# Altium schematic sheet Sheet1.SchDoc (part 1 of 5)
size A2; SheetNumber: 1; SheetTotal: 1
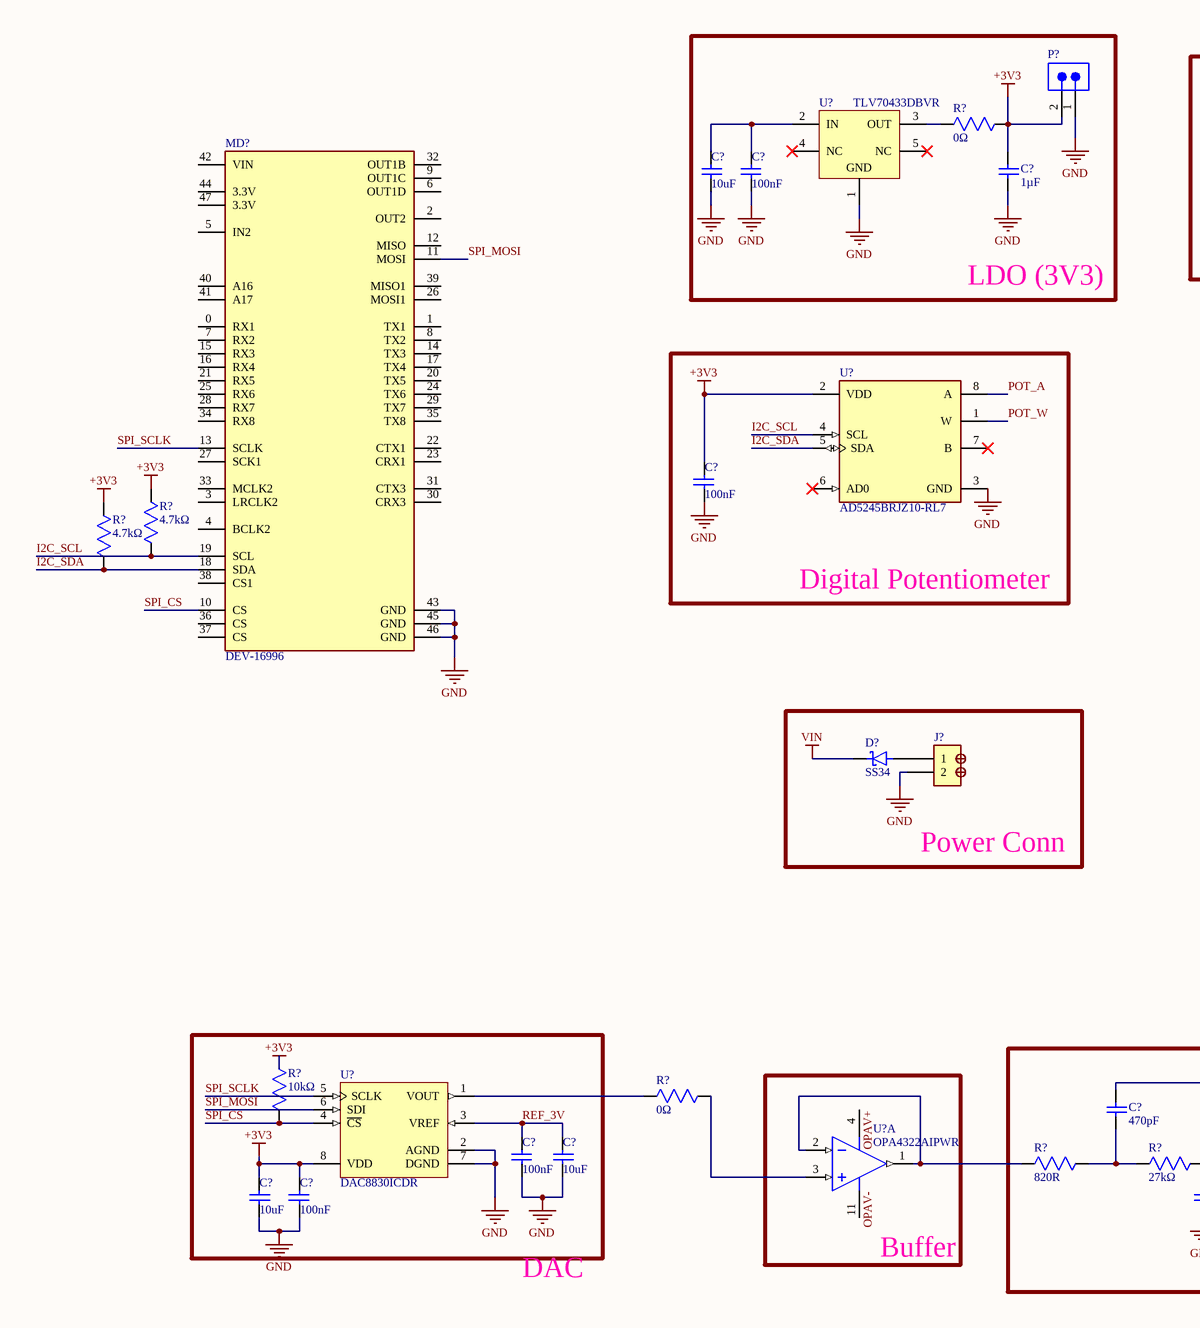
[diagram p0: Sheet1.SchDoc, left]
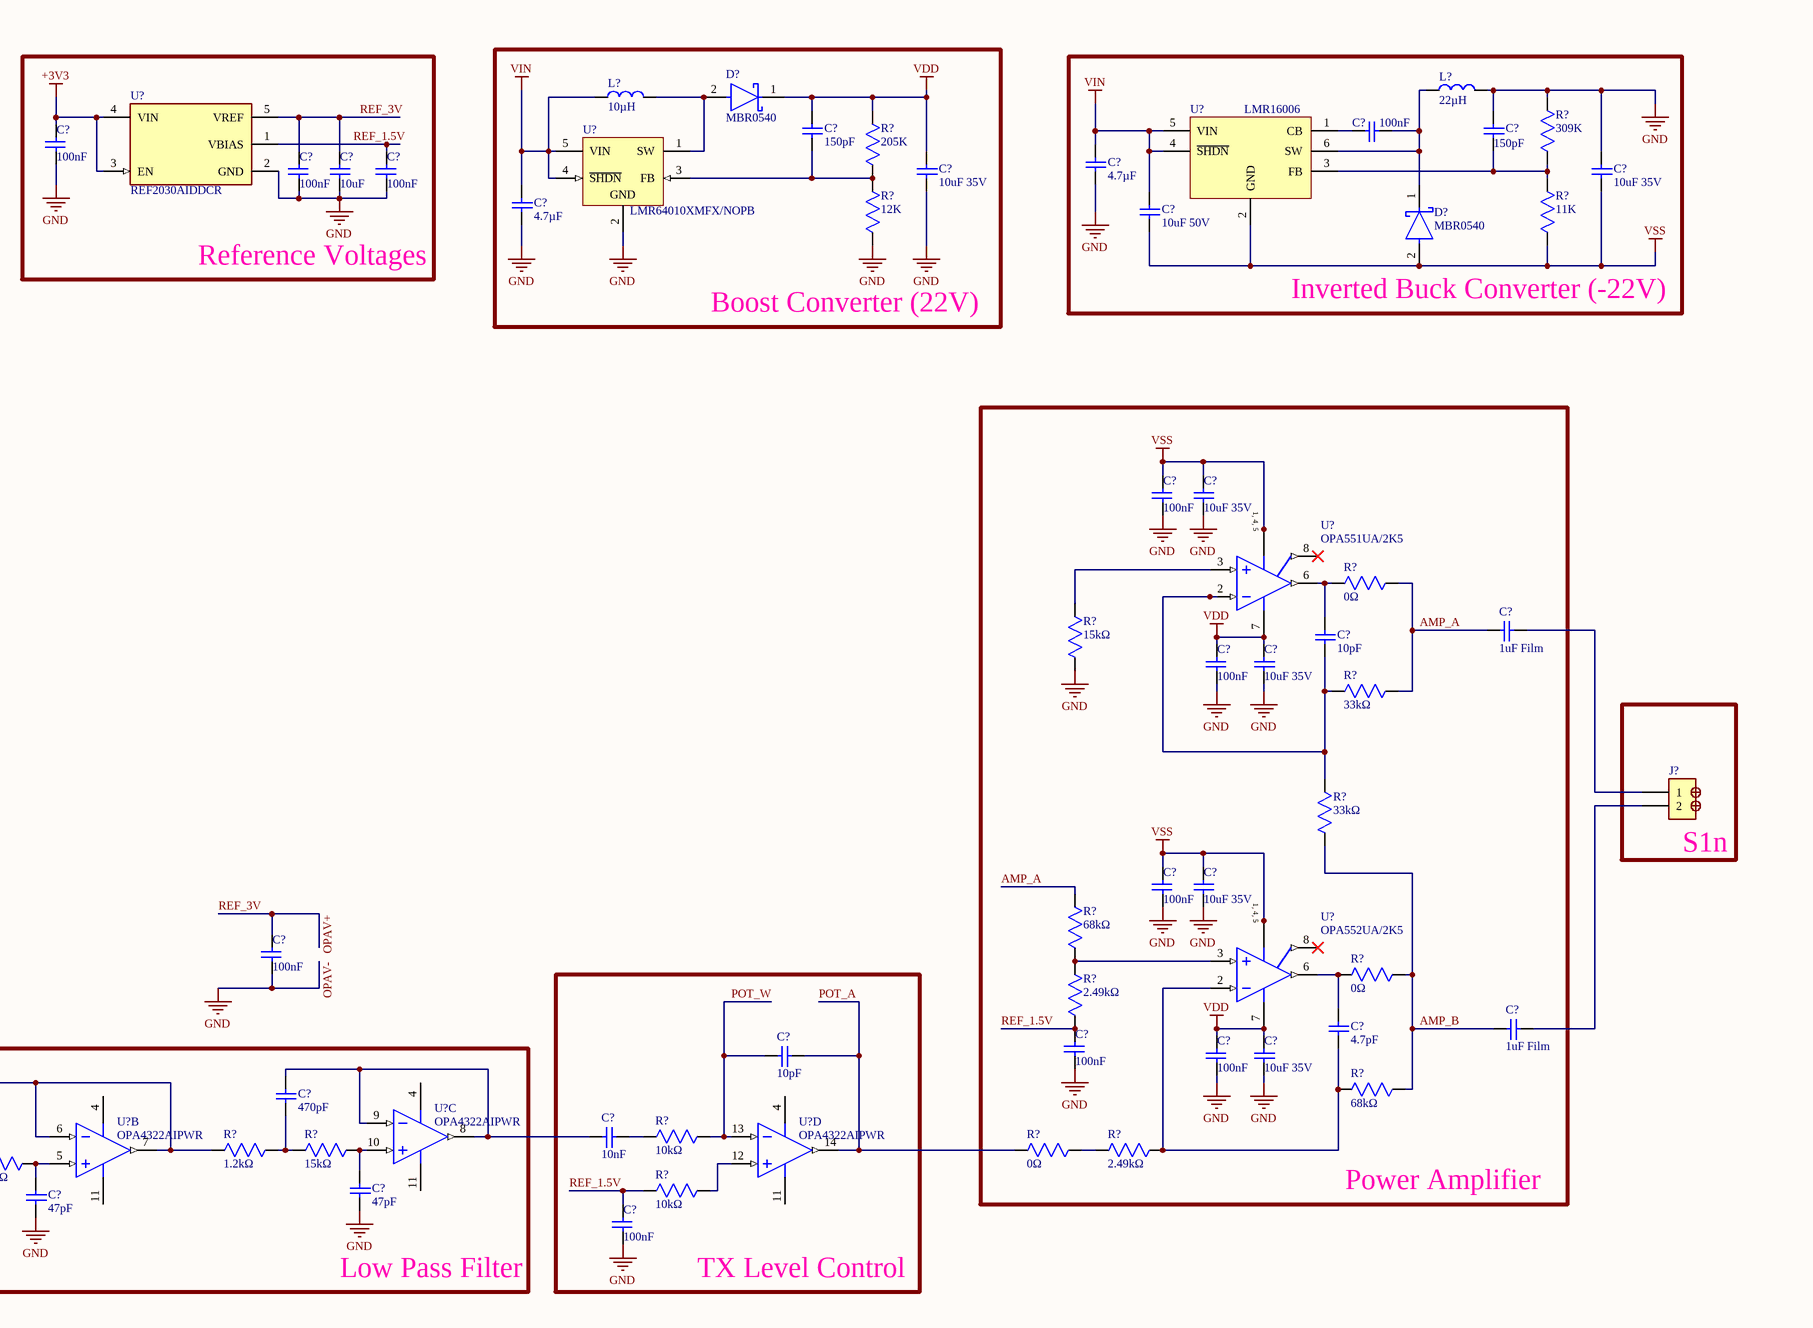
[diagram p1: Sheet1.SchDoc, right]

## Parts
(Parts that share a designator on the sheet are numbered #1, #2 ... from top to bottom, then left to right.)
C?#1  100nF  [CAP_0603]
C?#2  100nF  [CAP_0603]
C?#3  100nF  [CAP_0603]
C?#4  100nF  [CAP_0603]
C?#5  100nF  [CAP_0603]
C?#6  150pF  [CAP_0603]
C?#7  150pF  [CAP_0603]
C?#8  4.7µF  [CAP_0603]
C?#9  10uF  [CAP_0603]
C?#10  1µF  [CAP_0603]
C?#11  10uF  [CAP_0603]
C?#12  10uF 35V  [CAP_0603]
C?#13  10uF 35V  [CAP_0603]
C?#14  4.7µF  [CAP_0603]
C?#15  10uF 50V  [CAP_0603]
C?#16  100nF  [CAP_0603]
C?#17  100nF  [CAP_0603]
C?#18  10uF 35V  [CAP_0603]
C?#19  1uF Film  [PE105J2A0502]
C?#20  100nF  [CAP_0603]
C?#21  10pF  [CAP_0603]
C?#22  10uF 35V  [CAP_0603]
C?#23  100nF  [CAP_0603]
C?#24  10uF 35V  [CAP_0603]
C?#25  100nF  [CAP_0603]
C?#26  100nF  [CAP_0603]
C?#27  1uF Film  [PE105J2A0502]
C?#28  100nF  [CAP_0603]
C?#29  4.7pF  [CAP_0603]
C?#30  10pF  [CAP_0603]
C?#31  10uF 35V  [CAP_0603]
C?#32  470pF  [CAP_0603]
C?#33  470pF  [CAP_0603]
C?#34  100nF  [CAP_0603]
C?#35  10nF  [CAP_0603]
C?#36  100nF  [CAP_0603]
C?#37  10uF  [CAP_0603]
C?#38  100nF  [CAP_0603]
C?#39  47pF  [CAP_0603]
C?#40  10uF  [CAP_0603]
C?#41  47pF  [CAP_0603]
D?#1  MBR0540  [FP-425-04-MFG]
D?#2  MBR0540  [FP-425-04-MFG]
D?#3  SS34  [SS34]
J?#1  DB301V-3.5-2P-GN-S  [DB301V-3.5-2P-GN-S]  (value not drawn)
J?#2  DB301V-3.5-2P-GN-S  [DB301V-3.5-2P-GN-S]  (value not drawn)
L?#1  22µH  [SWPA5040S100MT]
L?#2  10µH  [SWPA5040S100MT]
MD?  DEV-16996  [FP-DEV-16996-MFG]
P?  DW-02-16-G-S-200  [SMTC-DW-02-16-X-S-200]  (value not drawn)
R?#1  0Ω
R?#2  309K  [RES_0603]
R?#3  205K  [RES_0603]
R?#4  12K  [RES_0603]
R?#5  11K  [RES_0603]
R?#6  4.7kΩ  [RES_0603]
R?#7  4.7kΩ  [RES_0603]
R?#8  0Ω
R?#9  15kΩ  [RES_0603]
R?#10  33kΩ  [RES_0603]
R?#11  33kΩ  [RES_0603]
R?#12  68kΩ  [RES_0603]
R?#13  0Ω
R?#14  2.49kΩ  [RES_0603]
R?#15  68kΩ  [RES_0603]
R?#16  0Ω
R?#17  10kΩ  [CAP_0603]
R?#18  10kΩ  [CAP_0603]
R?#19  1.2kΩ  [RES_0603]
R?#20  15kΩ  [RES_0603]
R?#21  0Ω
R?#22  2.49kΩ  [RES_0603]
R?#23  820R  [RES_0603]
R?#24  27kΩ  [RES_0603]
R?#25  10kΩ  [CAP_0603]
U?#1  TLV70433DBVR  [DBV0005A_M]
U?#2  REF2030AIDDCR  [FP-DDC0005A-IPC_A]
U?#3  LMR16006  [LMR16006YDDCR]
U?#4  LMR64010XMFX/NOPB  [DBV0005A_N]
U?#5  AD5245BRJZ10-RL7  [FP-RJ-8-IPC_B]
U?#6  OPA551UA/2K5  [D0008A_N]
U?#7  OPA552UA/2K5  [D0008A_N]
U?#8  DAC8830ICDR  [TI-D8_M]
U?#9  OPA4322AIPWR  [PW0014A_N]  (part C of 4)
U?#10  OPA4322AIPWR  [PW0014A_N]  (part B of 4)
U?#11  OPA4322AIPWR  [PW0014A_N]  (part D of 4)
U?#12  OPA4322AIPWR  [PW0014A_N]  (part A of 4)

## Blocks framed on the sheet
LDO (3V3): C?#3 C?#9 C?#10 P? R?#1 U?#1
Reference Voltages: C?#1 C?#4 C?#5 C?#11 U?#2
Boost Converter (22V): C?#6 C?#12 C?#14 D?#1 L?#2 R?#3 R?#4 U?#4
Inverted Buck Converter (-22V): C?#2 C?#7 C?#8 C?#13 C?#15 D?#2 L?#1 R?#2 R?#5 U?#3
Digital Potentiometer: C?#16 U?#5
Power Amplifier: C?#17-C?#24 C?#26-C?#29 C?#31 R?#8-R?#15 R?#21 R?#22 U?#6 U?#7
Power Conn: D?#3 J?#1
S1n: J?#2
TX Level Control: C?#30 C?#35 C?#38 R?#18 R?#25 U?#11
Buffer: U?#12
Low Pass Filter: C?#32 C?#33 C?#39 C?#41 R?#19 R?#20 R?#23 R?#24 U?#9 U?#10

## Nets
+3V3: C?#1.1 C?#10.2 C?#16.1 C?#36.1 C?#40.2 P?.2 R?#1.2 R?#6.2 R?#7.2 R?#17.2 U?#2.3(EN) U?#2.4(VIN) U?#5.2(VDD) U?#8.8(VDD)
OPAV-: C?#1.2 C?#3.2 C?#4.2 C?#5.2 C?#7.2 C?#8.1 C?#9.1 C?#10.1 C?#11.1 C?#12.1 C?#13.2 C?#14.1 C?#16.2 C?#17.2 C?#18.1 C?#20.2 C?#22.1 C?#23.2 C?#24.1 C?#25.2 C?#26.2 C?#28.2 C?#31.1 C?#34.2 C?#36.2 C?#37.1 C?#38.2 C?#39.1 C?#40.1 C?#41.1 J?#1.2 L?#1.2 MD?.43(GND) MD?.45(GND) MD?.46(GND) P?.1 R?#2.2 R?#4.1 R?#9.1 U?#1.1(GND) U?#2.2(GND) U?#4.2(GND) U?#5.3(GND) U?#8.2(AGND) U?#8.7(DGND)  [also labelled GND]
VDD: C?#6.2 C?#12.2 C?#20.1 C?#22.2 C?#28.1 C?#31.2 D?#1.1(C) R?#3.2 U?#6.7(V+) U?#7.7(V+)
VIN: C?#8.2 C?#14.2 C?#15.2 D?#3.K L?#2.1 U?#3.4(~{SHDN}) U?#3.5(VIN) U?#4.4(~{SHDN}) U?#4.5(VIN)
VSS: C?#13.1 C?#15.1 C?#17.1 C?#18.2 C?#23.1 C?#24.2 D?#2.2(A) R?#5.1 U?#3.2(GND) U?#6.1(V-) U?#6.4(V-) U?#6.5(V-) U?#7.1(V-) U?#7.4(V-) U?#7.5(V-)
AMP_A: C?#19.1 R?#8.2 R?#10.1 R?#12.2
AMP_B: C?#27.1 R?#11.1 R?#13.2 R?#15.2
I2C_SCL: MD?.19(SCL) R?#6.1 U?#5.4(SCL)
I2C_SDA: MD?.18(SDA) R?#7.1 U?#5.5(SDA)
OPAV+: C?#4.1 C?#11.2 C?#25.1 C?#34.1 C?#37.2 U?#2.5(VREF) U?#8.3(VREF) U?#12.4(V+)  [also labelled REF_3V]
POT_A: C?#30.2 R?#21.1 U?#5.8(A) U?#11.14(OUT_D)
POT_W: C?#30.1 R?#18.2 U?#5.1(W) U?#11.13(IN_D-)
REF_1.5V: C?#5.1 C?#26.1 C?#38.1 R?#14.1 R?#25.1 U?#2.1(VBIAS)
SPI_CS: MD?.10(CS) R?#17.1 U?#8.4(~{CS})
SPI_MOSI: MD?.11(MOSI) U?#8.6(SDI)
SPI_SCLK: MD?.13(SCLK) U?#8.5(SCLK)
NetC?#2_1: C?#2.1 U?#3.1(CB)
NetC?#2_2: C?#2.2 D?#2.1(C) L?#1.1 U?#3.6(SW)
NetC?#3_1: C?#3.1 C?#9.2 U?#1.2(IN)
NetC?#6_1: C?#6.1 R?#3.1 R?#4.2 U?#4.3(FB)
NetC?#7_1: C?#7.1 R?#2.1 R?#5.2 U?#3.3(FB)
NetC?#19_2: C?#19.2 J?#2.1
NetC?#21_1: C?#21.1 R?#10.2 R?#11.2 U?#6.2(IN-)
NetC?#21_2: C?#21.2 R?#8.1 U?#6.6(OUT)
NetC?#27_2: C?#27.2 J?#2.2
NetC?#29_1: C?#29.1 R?#15.1 R?#22.2 U?#7.2(IN-)
NetC?#29_2: C?#29.2 R?#13.1 U?#7.6(OUT)
NetC?#32_1: C?#32.1 R?#19.2 R?#20.1
NetC?#32_2: C?#32.2 C?#35.1 U?#9.8(OUT_C) U?#9.9(IN_C-)
NetC?#33_1: C?#33.1 R?#23.2 R?#24.1
NetC?#33_2: C?#33.2 R?#19.1 U?#10.6(IN_B-) U?#10.7(OUT_B)
NetC?#35_2: C?#35.2 R?#18.1
NetC?#39_2: C?#39.2 R?#20.2 U?#9.10(IN_C+)
NetC?#41_2: C?#41.2 R?#24.2 U?#10.5(IN_B+)
NetD?#1_2: D?#1.2(A) L?#2.2 U?#4.1(SW)
NetD?#3_A: D?#3.A J?#1.1
NetR?#1_1: R?#1.1 U?#1.3(OUT)
NetR?#9_2: R?#9.2 U?#6.3(IN+)
NetR?#12_1: R?#12.1 R?#14.2 U?#7.3(IN+)
NetR?#16_1: R?#16.1 U?#8.1(VOUT)
NetR?#16_2: R?#16.2 U?#12.3(IN_A+)
NetR?#21_2: R?#21.2 R?#22.1
NetR?#23_1: R?#23.1 U?#12.1(OUT_A) U?#12.2(IN_A-)
NetR?#25_2: R?#25.2 U?#11.12(IN_D+)

Not connected (* = marked no-connect by the designer): MD? 0(RX1) 1(TX1) 2(OUT2) 3(LRCLK2) 4(BCLK2) 5(IN2) 6(OUT1D) 7(RX2) 8(TX2) 9(OUT1C) 12(MISO) 14(TX3) 15(RX3) 16(RX4) 17(TX4) 20(TX5) 21(RX5) 22(CTX1) 23(CRX1) 24(TX6) 25(RX6) 26(MOSI1) 27(SCK1) 28(RX7) 29(TX7) 30(CRX3) 31(CTX3) 32(OUT1B) 33(MCLK2) 34(RX8) 35(TX8) 36(CS) 37(CS) 38(CS1) 39(MISO1) 40(A16) 41(A17) 42(VIN) 44(3.3V) 47(3.3V); U?#1 4(NC)* 5(NC)*; U?#5 6(AD0)* 7(B)*; U?#6 8(FLAG)*; U?#7 8(FLAG)*; U?#9 4(V+) 11(V-); U?#10 4(V+) 11(V-); U?#11 4(V+) 11(V-); U?#12 11(V-)

## Notes on the sheet
- DAC
- Labels drawn without touching a wire or pin: OPAV-
- (in symbol CMP-0272-03257-3) 1, 4, 5
- (in symbol CMP-0272-03266-3) 1, 4, 5